# Altium schematic sheet Flash.SchDoc
size A4
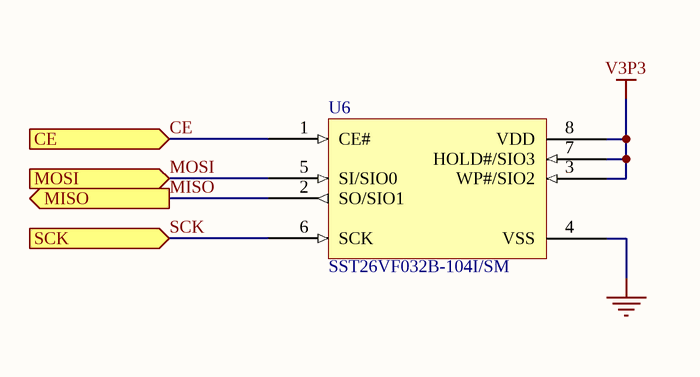
[diagram p0: Flash.SchDoc]

## Parts
U6  SST26VF032B-104I/SM  [SOIC 8]

## Ports
CE (in), MISO (out), MOSI (in), SCK (in)

## Nets
GND: U6.4(VSS)
V3P3: U6.3(WP#/SIO2) U6.7(HOLD#/SIO3) U6.8(VDD)
CE: U6.1(CE#) ; port CE
MISO: U6.2(SO/SIO1) ; port MISO
MOSI: U6.5(SI/SIO0) ; port MOSI
SCK: U6.6(SCK) ; port SCK

## Notes on the sheet
- Title
- Size:
- Date:
- A4
- Number:
- Time:
- Revision:
- Sheet
- of
- File:

## Library data of the parts
U6 = SST26VF032B-104I/SM: Fabricant: MICROCHIP; Fournisseur: Farnell; RefFournisseur: 2471177; RefFabricant: SST26VF032B-104I/SM